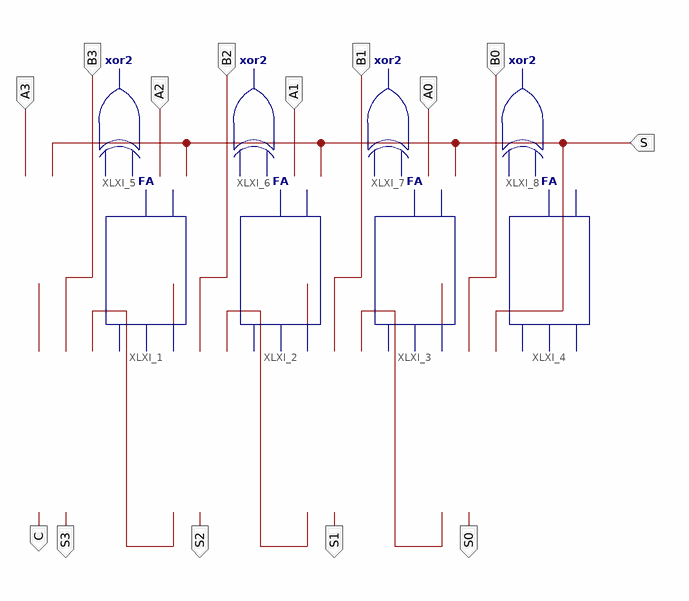
[diagram p0: schematic sheet 1]
// Xilinx ISE schematic Add_Subtract_unit_4_bit.sch (spartan3e) as structural Verilog: 8 symbols, 14 ports
module Add_Subtract_unit_4_bit (
  input  S,
  input  A3,
  input  A2,
  input  A1,
  input  A0,
  input  B3,
  input  B2,
  input  B1,
  input  B0,
  output C,
  output S3,
  output S2,
  output S1,
  output S0
);

  wire XLXN_1, XLXN_2, XLXN_3, XLXN_4, XLXN_5, XLXN_6, XLXN_7;

  FA XLXI_1 (.A(XLXN_1), .B(B3), .C_in(XLXN_5), .C_out(C), .S(S3));
  FA XLXI_2 (.A(XLXN_2), .B(B2), .C_in(XLXN_6), .C_out(XLXN_5), .S(S2));
  FA XLXI_3 (.A(XLXN_3), .B(B1), .C_in(XLXN_7), .C_out(XLXN_6), .S(S1));
  FA XLXI_4 (.A(XLXN_4), .B(B0), .C_in(S), .C_out(XLXN_7), .S(S0));
  xor XLXI_5 (XLXN_1, S, A3);
  xor XLXI_6 (XLXN_2, S, A2);
  xor XLXI_7 (XLXN_3, S, A1);
  xor XLXI_8 (XLXN_4, S, A0);
endmodule
